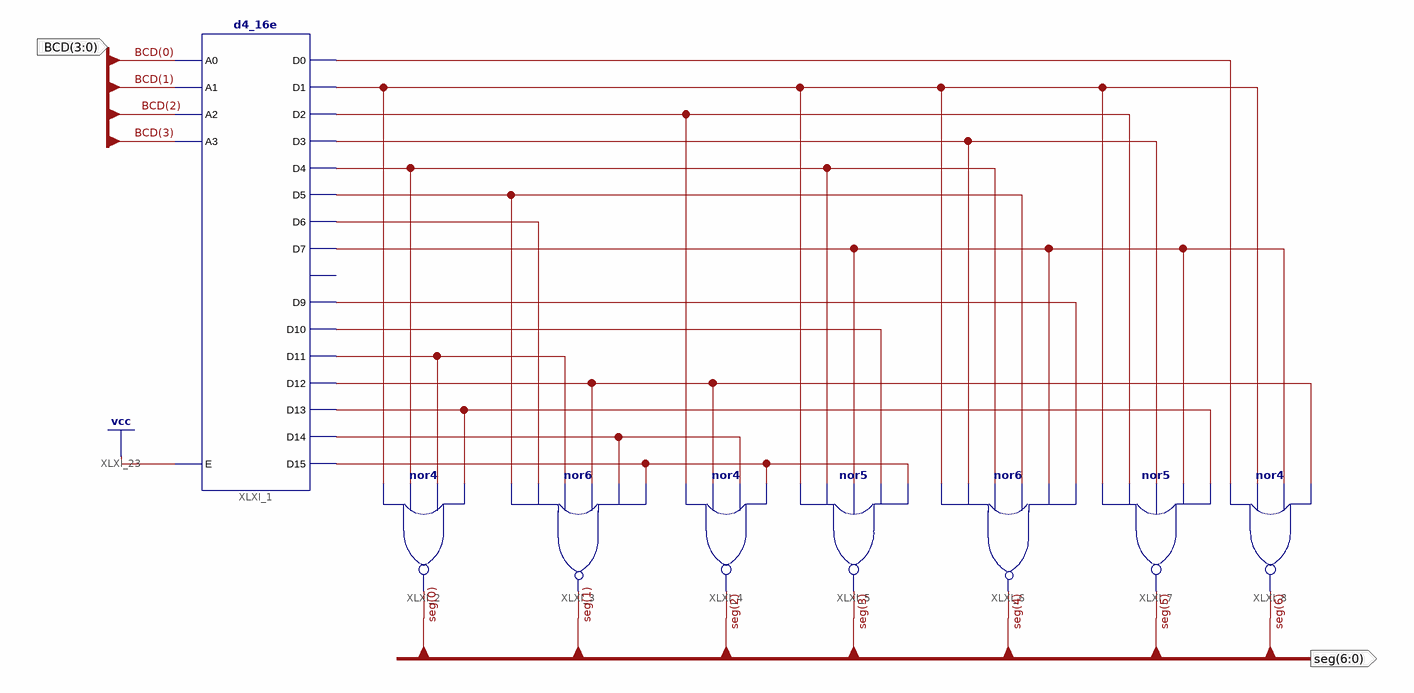
[diagram p0: schematic sheet 1]
// Xilinx ISE schematic Hex_to_7seg.sch (spartan6) as structural Verilog: 8 symbols, 2 ports
module Hex_to_7seg (
  input  [3:0] BCD,
  output [6:0] seg
);

  wire XLXN_1, XLXN_2, XLXN_3, XLXN_4, XLXN_5, XLXN_6, XLXN_8, XLXN_9, XLXN_10, XLXN_11, XLXN_17, XLXN_18,
       XLXN_21, XLXN_25, XLXN_32;

  d4_16e XLXI_1 (
    .A0(BCD[0]), .A1(BCD[1]), .A2(BCD[2]), .A3(BCD[3]), .E(1'b1), .D0(XLXN_32), .D1(XLXN_1), .D10(XLXN_18),
    .D11(XLXN_3), .D12(XLXN_8), .D13(XLXN_4), .D14(XLXN_9), .D15(XLXN_10), .D2(XLXN_11), .D3(XLXN_21),
    .D4(XLXN_2), .D5(XLXN_5), .D6(XLXN_6), .D7(XLXN_17), .D9(XLXN_25));  // open: D8
  nor XLXI_3 (seg[1], XLXN_5, XLXN_6, XLXN_3, XLXN_8, XLXN_9, XLXN_10);
  nor XLXI_4 (seg[2], XLXN_11, XLXN_8, XLXN_9, XLXN_10);
  nor XLXI_5 (seg[3], XLXN_1, XLXN_2, XLXN_17, XLXN_18, XLXN_10);
  nor XLXI_6 (seg[4], XLXN_1, XLXN_21, XLXN_2, XLXN_5, XLXN_17, XLXN_25);
  nor XLXI_7 (seg[5], XLXN_1, XLXN_11, XLXN_21, XLXN_17, XLXN_4);
  nor XLXI_8 (seg[6], XLXN_32, XLXN_1, XLXN_17, XLXN_8);
  nor XLXI_2 (seg[0], XLXN_1, XLXN_2, XLXN_3, XLXN_4);
endmodule
